# Altium schematic sheet GNSS Module.SchDoc: NER A Size Template
size Tabloid; ApprovedBy: WS; DrawnBy: Cameron Gordon & Elise Cooke; Address4: X.X.X; Revision: 1; SheetNumber: 1; SheetTotal: 3
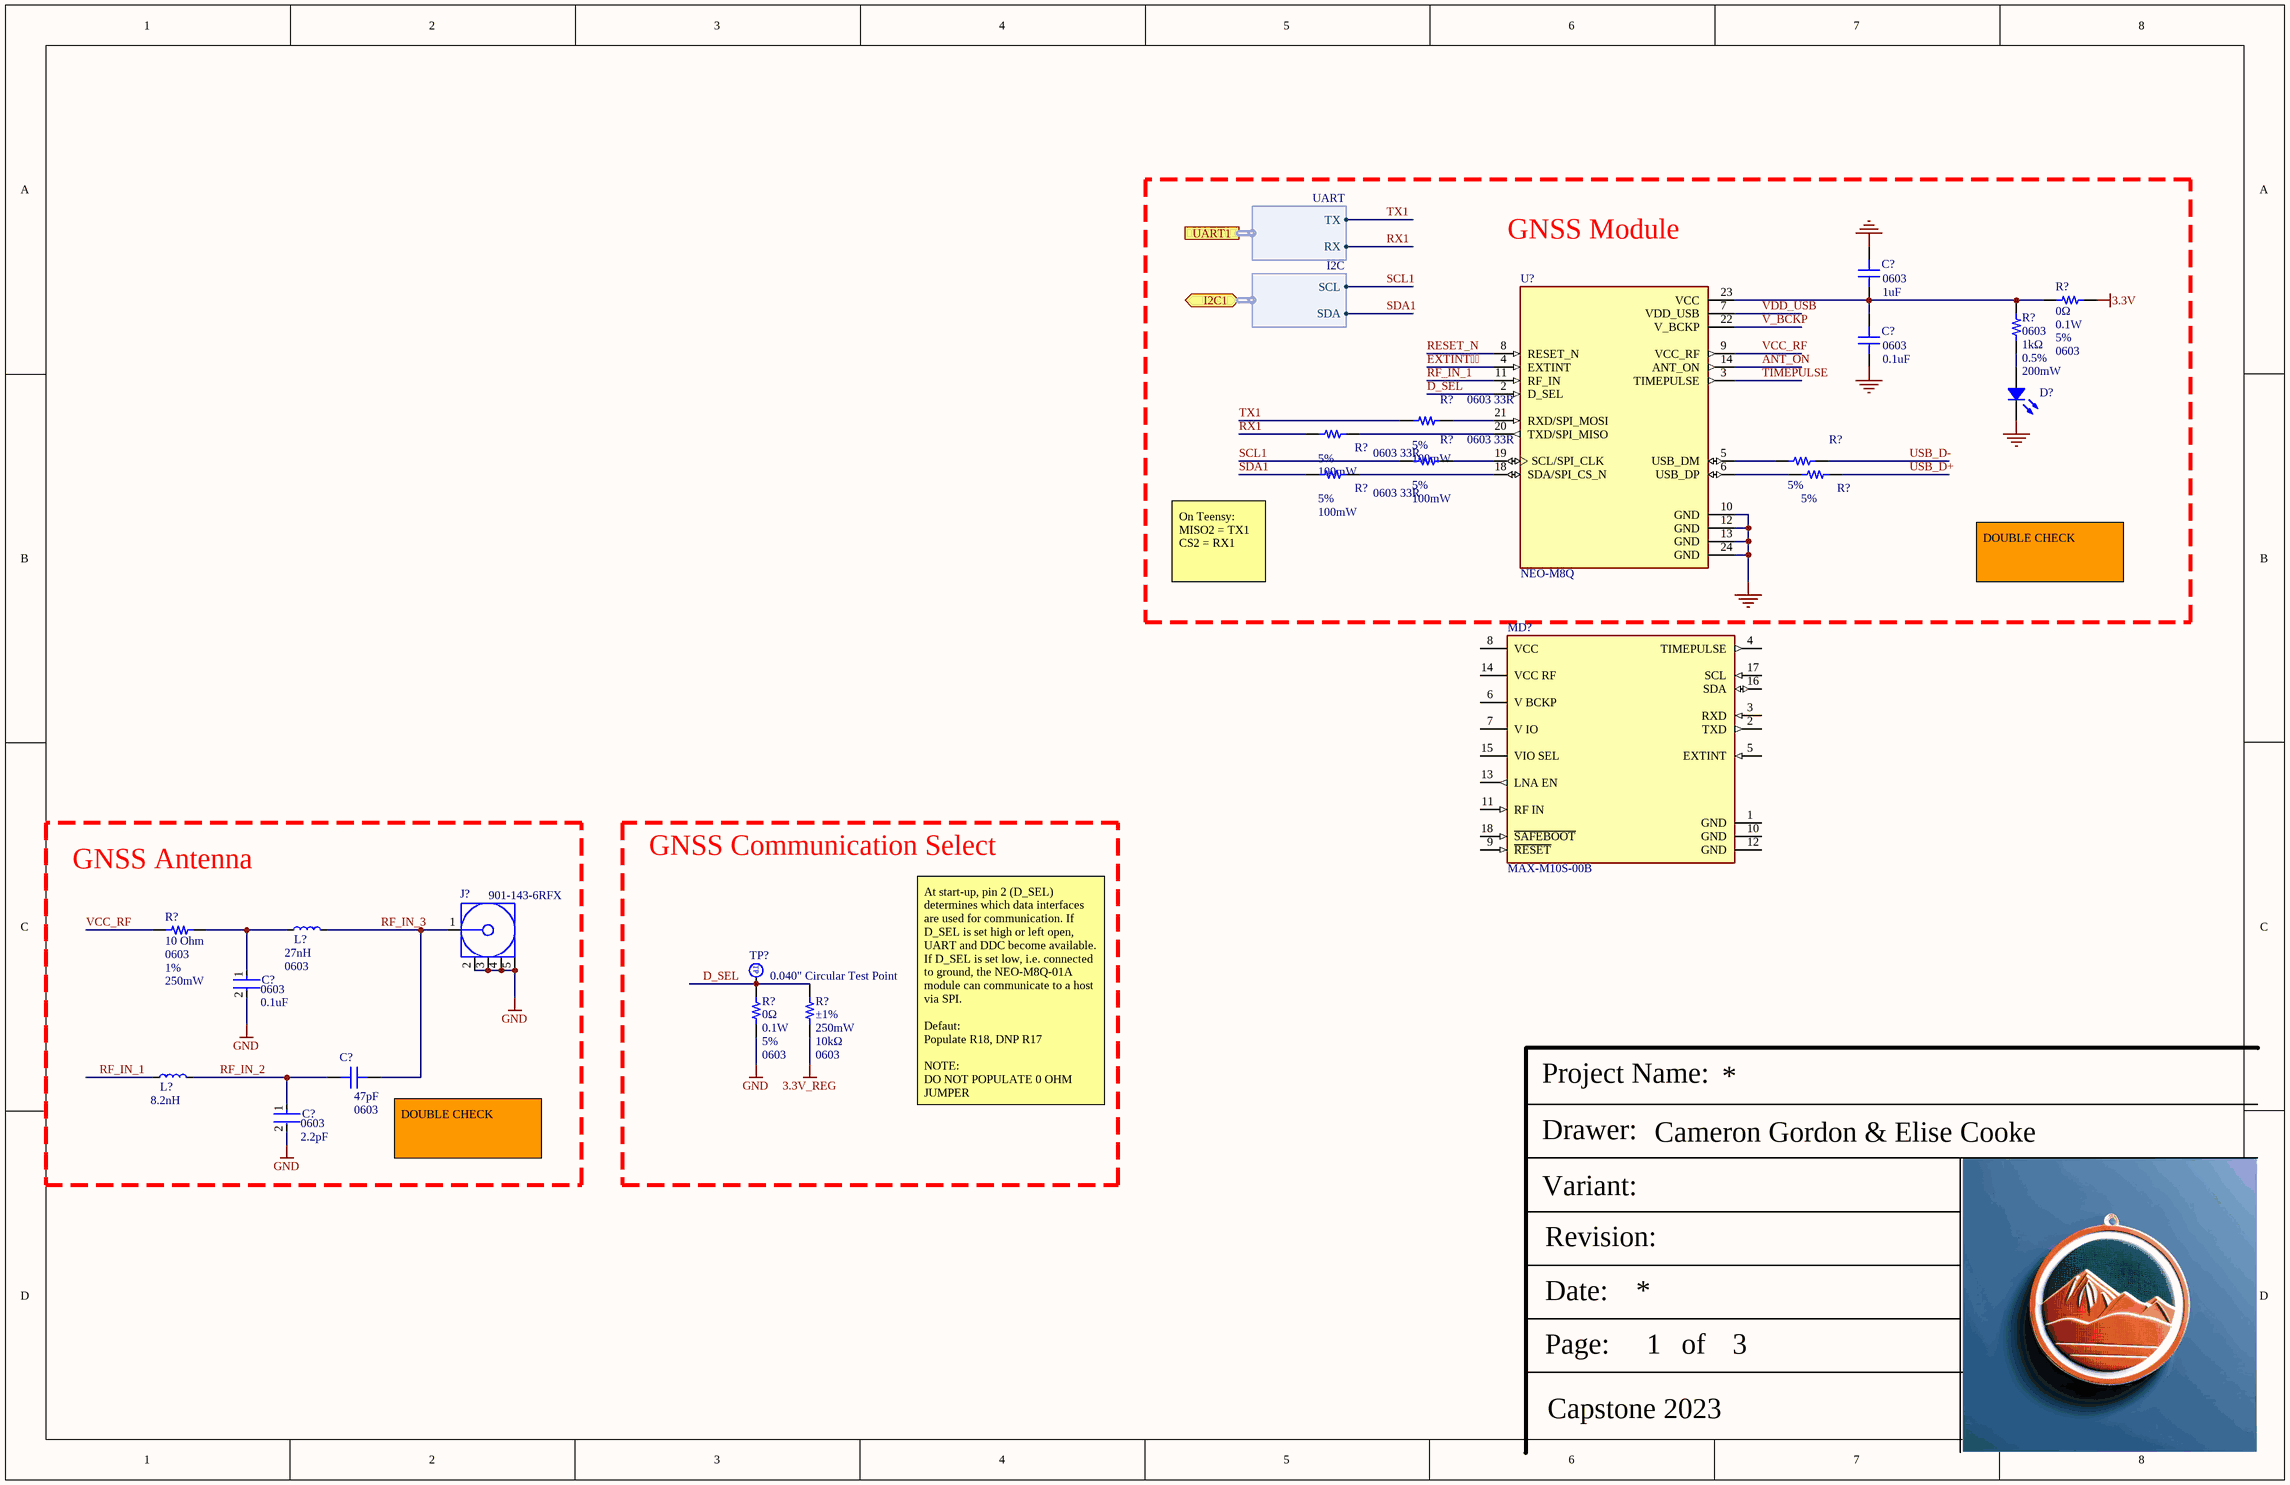
[diagram p0: GNSS Module.SchDoc]

## Parts
(Parts that share a designator on the sheet are numbered #1, #2 ... from top to bottom, then left to right.)
C?#1  Capacitance: 1uF  Case/Package: 0603  [0603 Ceramic Capacitor]  (hidden comment: GCM188R71E105KA64D)
C?#2  Capacitance: 0.1uF  Package: 0603  [0603 Ceramic Capacitor]  (hidden comment: CC0603KPX7R8BB104)
C?#3  Capacitance: 0.1uF  Package: 0603  [FP-CL10-IPC_B]  (hidden comment: CL10B104KO8WPNC)
C?#4  Case/Package: 0603  Capacitance: 47pF  [0603 Ceramic Capacitor]  (hidden comment: 06035C470KAT2A)
C?#5  Capacitance: 2.2pF  Package: 0603  [FP-CGA3E-0_3-0_1-MFG]  (hidden comment: CGA3E2C0G1H2R2C080AA)
D?  TLMG1100-GS08  [0603 LED]  (value not drawn)
J?  901-143-6RFX  [AMPH-901-143-6RFX_V]
L?#1  Inductance: 27nH  Package: 0603  [0603 Resistor]  (hidden comment: B82496C3270J000)
L?#2  Inductance: 8.2nH  [INDC1608X90N]  (hidden comment: B82496C3829J000)
MD?  MAX-M10S-00B  [FP-MAX-M10S-00B-MFG]
R?#1  Resistance: 0Ω  Power Rating: 0.1W  Tolerance: 5%  Package: 0603  [0603 Resistor]  (hidden comment: ERJ-S030R00V)
R?#2  Package: 0603  Resistance: 1kΩ  Tolerance: 0.5%  Power Rating: 200mW  [0603 Resistor]  (hidden comment: ERJ-PB3D1001V)
R?#3  Package: 0603  Resistance: 33R  Tolerance: 5%  Power Rating: 100mW  [0603 Resistor]  (hidden comment: CRGCQ0603J33R)
R?#4  Package: 0603  Resistance: 33R  Tolerance: 5%  Power Rating: 100mW  [0603 Resistor]  (hidden comment: CRGCQ0603J33R)
R?#5  Package: 0603  Resistance: 33R  Tolerance: 5%  Power Rating: 100mW  [0603 Resistor]  (hidden comment: CRGCQ0603J33R)
R?#6  Tolerance: 5%  [0603 Resistor]  (hidden comment: ESR03EZPJ270)
R?#7  Package: 0603  Resistance: 33R  Tolerance: 5%  Power Rating: 100mW  [0603 Resistor]  (hidden comment: CRGCQ0603J33R)
R?#8  Tolerance: 5%  [0603 Resistor]  (hidden comment: ESR03EZPJ270)
R?#9  Resistance: 10 Ohm  Package: 0603  Tolerance: 1%  Power Rating: 250mW  [0603 Resistor]  (hidden comment: ERJ-UP3F10R0V)
R?#10  Resistance: 0Ω  Power Rating: 0.1W  Tolerance: 5%  Package: 0603  [0603 Resistor]  (hidden comment: ERJ-S030R00V)
R?#11  Tolerance: ±1%  Power Rating: 250mW  Resistance: 10kΩ  Package: 0603  [0603 Resistor]  (hidden comment: ERJ-PA3F1002V)
TP?  0.040" Circular Test Point  [40 mil Circular Test Point]
U?  NEO-M8Q  [XCVR_NEO-M8Q]

## Blocks framed on the sheet
GNSS Module: C?#1 C?#2 D? R?#1-R?#8 U?
GNSS Antenna: C?#3-C?#5 J? L?#1 L?#2 R?#9
GNSS Communication Select: R?#10 R?#11 TP?

## Ports
I2C1 (bidir, harness I2C), UART1 (harness UART)

## Harnesses
UART: TX, RX
I2C: SCL, SDA

## Nets
3.3V: R?#1.1
3.3V_REG: R?#11.1
GND: C?#1.2 C?#2.1 C?#3.2 C?#5.2 D?.2 J?.2 J?.3 J?.4 J?.5 R?#10.1 U?.10(GND) U?.12(GND) U?.13(GND) U?.24(GND)
ANT_ON: U?.14(ANT_ON)
D_SEL: R?#10.2 R?#11.2 TP?.1 U?.2(D_SEL)
EXTINT: U?.4(EXTINT)
RESET_N: U?.8(RESET_N)
RF_IN_1: L?#2.1 U?.11(RF_IN)
RF_IN_2: C?#4.1 C?#5.1 L?#2.2
RF_IN_3: C?#4.2 J?.1 L?#1.2
RX1: R?#4.1 ; port UART1.RX
SCL1: R?#5.1 ; port I2C1.SCL
SDA1: R?#7.1 ; port I2C1.SDA
TIMEPULSE: U?.3(TIMEPULSE)
TX1: R?#3.1 ; port UART1.TX
USB_D+: R?#8.2
USB_D-: R?#6.2
V_BCKP: U?.22(V_BCKP)
VCC_RF: R?#9.2 U?.9(VCC_RF)
VDD_USB: U?.7(VDD_USB)
NetC?#1_1: C?#1.1 C?#2.2 R?#1.2 R?#2.2 U?.23(VCC)
NetC?#3_1: C?#3.1 L?#1.1 R?#9.1
NetD?_1: D?.1 R?#2.1
NetR?#3_2: R?#3.2 U?.21(RXD/SPI_MOSI)
NetR?#4_2: R?#4.2 U?.20(TXD/SPI_MISO)
NetR?#5_2: R?#5.2 U?.19(SCL/SPI_CLK)
NetR?#6_1: R?#6.1 U?.5(USB_DM)
NetR?#7_2: R?#7.2 U?.18(SDA/SPI_CS_N)
NetR?#8_1: R?#8.1 U?.6(USB_DP)

Not connected (* = marked no-connect by the designer): MD? 1(GND) 2(TXD) 3(RXD) 4(TIMEPULSE) 5(EXTINT) 6(V_BCKP) 7(V_IO) 8(VCC) 9(~{RESET}) 10(GND) 11(RF_IN) 12(GND) 13(LNA_EN) 14(VCC_RF) 15(VIO_SEL) 16(SDA) 17(SCL) 18(~{SAFEBOOT})

## Notes on the sheet
- On Teensy:
  MISO2 = TX1
  CS2 = RX1
- DOUBLE CHECK
- At start-up, pin 2 (D_SEL) determines which data interfaces are used for communication. If D_SEL is set high or left open, UART and DDC become available. If D_SEL is set low, i.e. connected to ground, the NEO-M8Q-01A module can communicate to a host via SPI.
  Defaut:
  Populate R18, DNP R17
  NOTE:
  DO NOT POPULATE 0 OHM JUMPER
- (near C?#4) DOUBLE CHECK
- Project Name:
- Drawer:
- Variant:
- Revision:
- Date:
- Page:
- of
- Capstone 2023
- (in symbol CMP-00017-2) TP

## Library data of the parts
C?#1 = CMP-001-0215-1: CAP CER 1UF 25V X7R 0603; Tolerance: 10%; Voltage: 25V; Dielectric: X7R
C?#2 = CMP-001-0195-1: 0603 0.1 uF 25 V ±10% Tolerance X7R SMT Multilayer Ceramic Capacitor; Voltage Rating: 25V; Case/Package: 0603; Tolerance: 10%; Dielectric: X7R
C?#3 = CMP-00135-1: Cap Ceramic 0.1uF 16V X7R 10% Pad SMD 0603 Soft Termination 125°C Automotive T/R
C?#4 = CMP-001-0207-1: 0603 47 pF 50 V ±10 % Tolerance X7R Surface Mount Multilayer Ceramic Capacitor; Voltage Rating: 50V; Tolerance: 10%
C?#5 = CMP-00137-1: Cap Ceramic 2.2pF 50V C0G 0.25pF SMD 0603 125 Automotive Paper T/R
D? = CMP-001-0026-2: 0603 Green LED; Forward Voltage: 2.1V; Max Current: 30mA; Package: 0603; Color: Green
J? = CMP-00176-1: connector, rf coaxial, sma rt angle pcb jack recept, 4 legs, blunt post term, gold
L?#1 = CMP-00186-1: EPCOS   B82496C3270J000   INDUCTOR, 0603, 27NH, 0.36A, 5%
L?#2 = CMP-00136-2: FIXED IND 8.2NH 650MA 180 MOHM; Parameter 1: *
MD? = CMP-207130-000026-1: GNSS LCC RX, ROM, TCXO, LNA, SAW
R?#1 R?#10 = CMP-001-0017-3: 0603 Resistor, 0Ω, ±5%, 0.1W
R?#2 = CMP-001-0008-3: 0603 Resistor, 1kΩ, ±0.5%, 200mW
R?#3-R?#5 R?#7 = CMP-00148-2: Res Thick Film 0603 33 Ohm 5% 0.1W(1/10W) ±200ppm/C Pad SMD Automotive T/R
R?#6 R?#8 = CMP-00147-2: Res Thick Film 0603 27 Ohm 5% 0.25W(1/4W) ±200ppm/C Pad SMD Automotive T/R; Value: 27R; Max Power Dissipation: 250mW; Case/Package: 0603
R?#9 = CMP-001-0149-2: Res Thick Film 0603 10 Ohm 1% 0.25W(1/4W) ±100ppm/C Sulfur Resistant Pad SMD Automotive T/R
R?#11 = CMP-001-0051-2: 0603 Resistor, 10kΩ, ±1%, 250mW
TP? = CMP-00017-2
U? = CMP-002-000008-1: NEO-M8 RF Receiver BeiDou, Galileo, GLONASS, GNSS, GPS 1.575GHz -167dBm; MF: U-Blox America; Package: LCC-24 u-blox; MP: NEO-M8Q; Component Type: Standard; Price: None; Source: SnapEDAsch.SchLib; Design Item ID: NEO-M8Q; SnapEDA_Link: https://www.snapeda.com/parts/NEO-M8Q/U-Blox%20America%20Inc./view-part/559765/?ref=snap; Availability: Unavailable; Pin Count: 20; Value: *